# Altium schematic sheet SCH-ZB206B-0B.SchDoc: Title
size A3; PageSetup: Record=PageOptions|CenterHorizontal=True|CenterVertical=True|PrintScale=1.00|XCorrection=1.00|YCorrection=1.00|PrintKind=0|BorderSize=5000000|LeftOffset=0|BottomOffset=0|Orientation=2|PaperLength=1000|PaperWidth=1000|Scale=100|PaperSource=7|PrintQuality=-4|MediaType=1|DitherType=10|PaperKind=A4|PrintScaleMode=1; ApprovedBy: Approve; CheckedBy: Check; DrawnBy: 叶天宝; Organization: HNS; DocumentNumber: 5; SheetNumber: 5; SheetTotal: 5
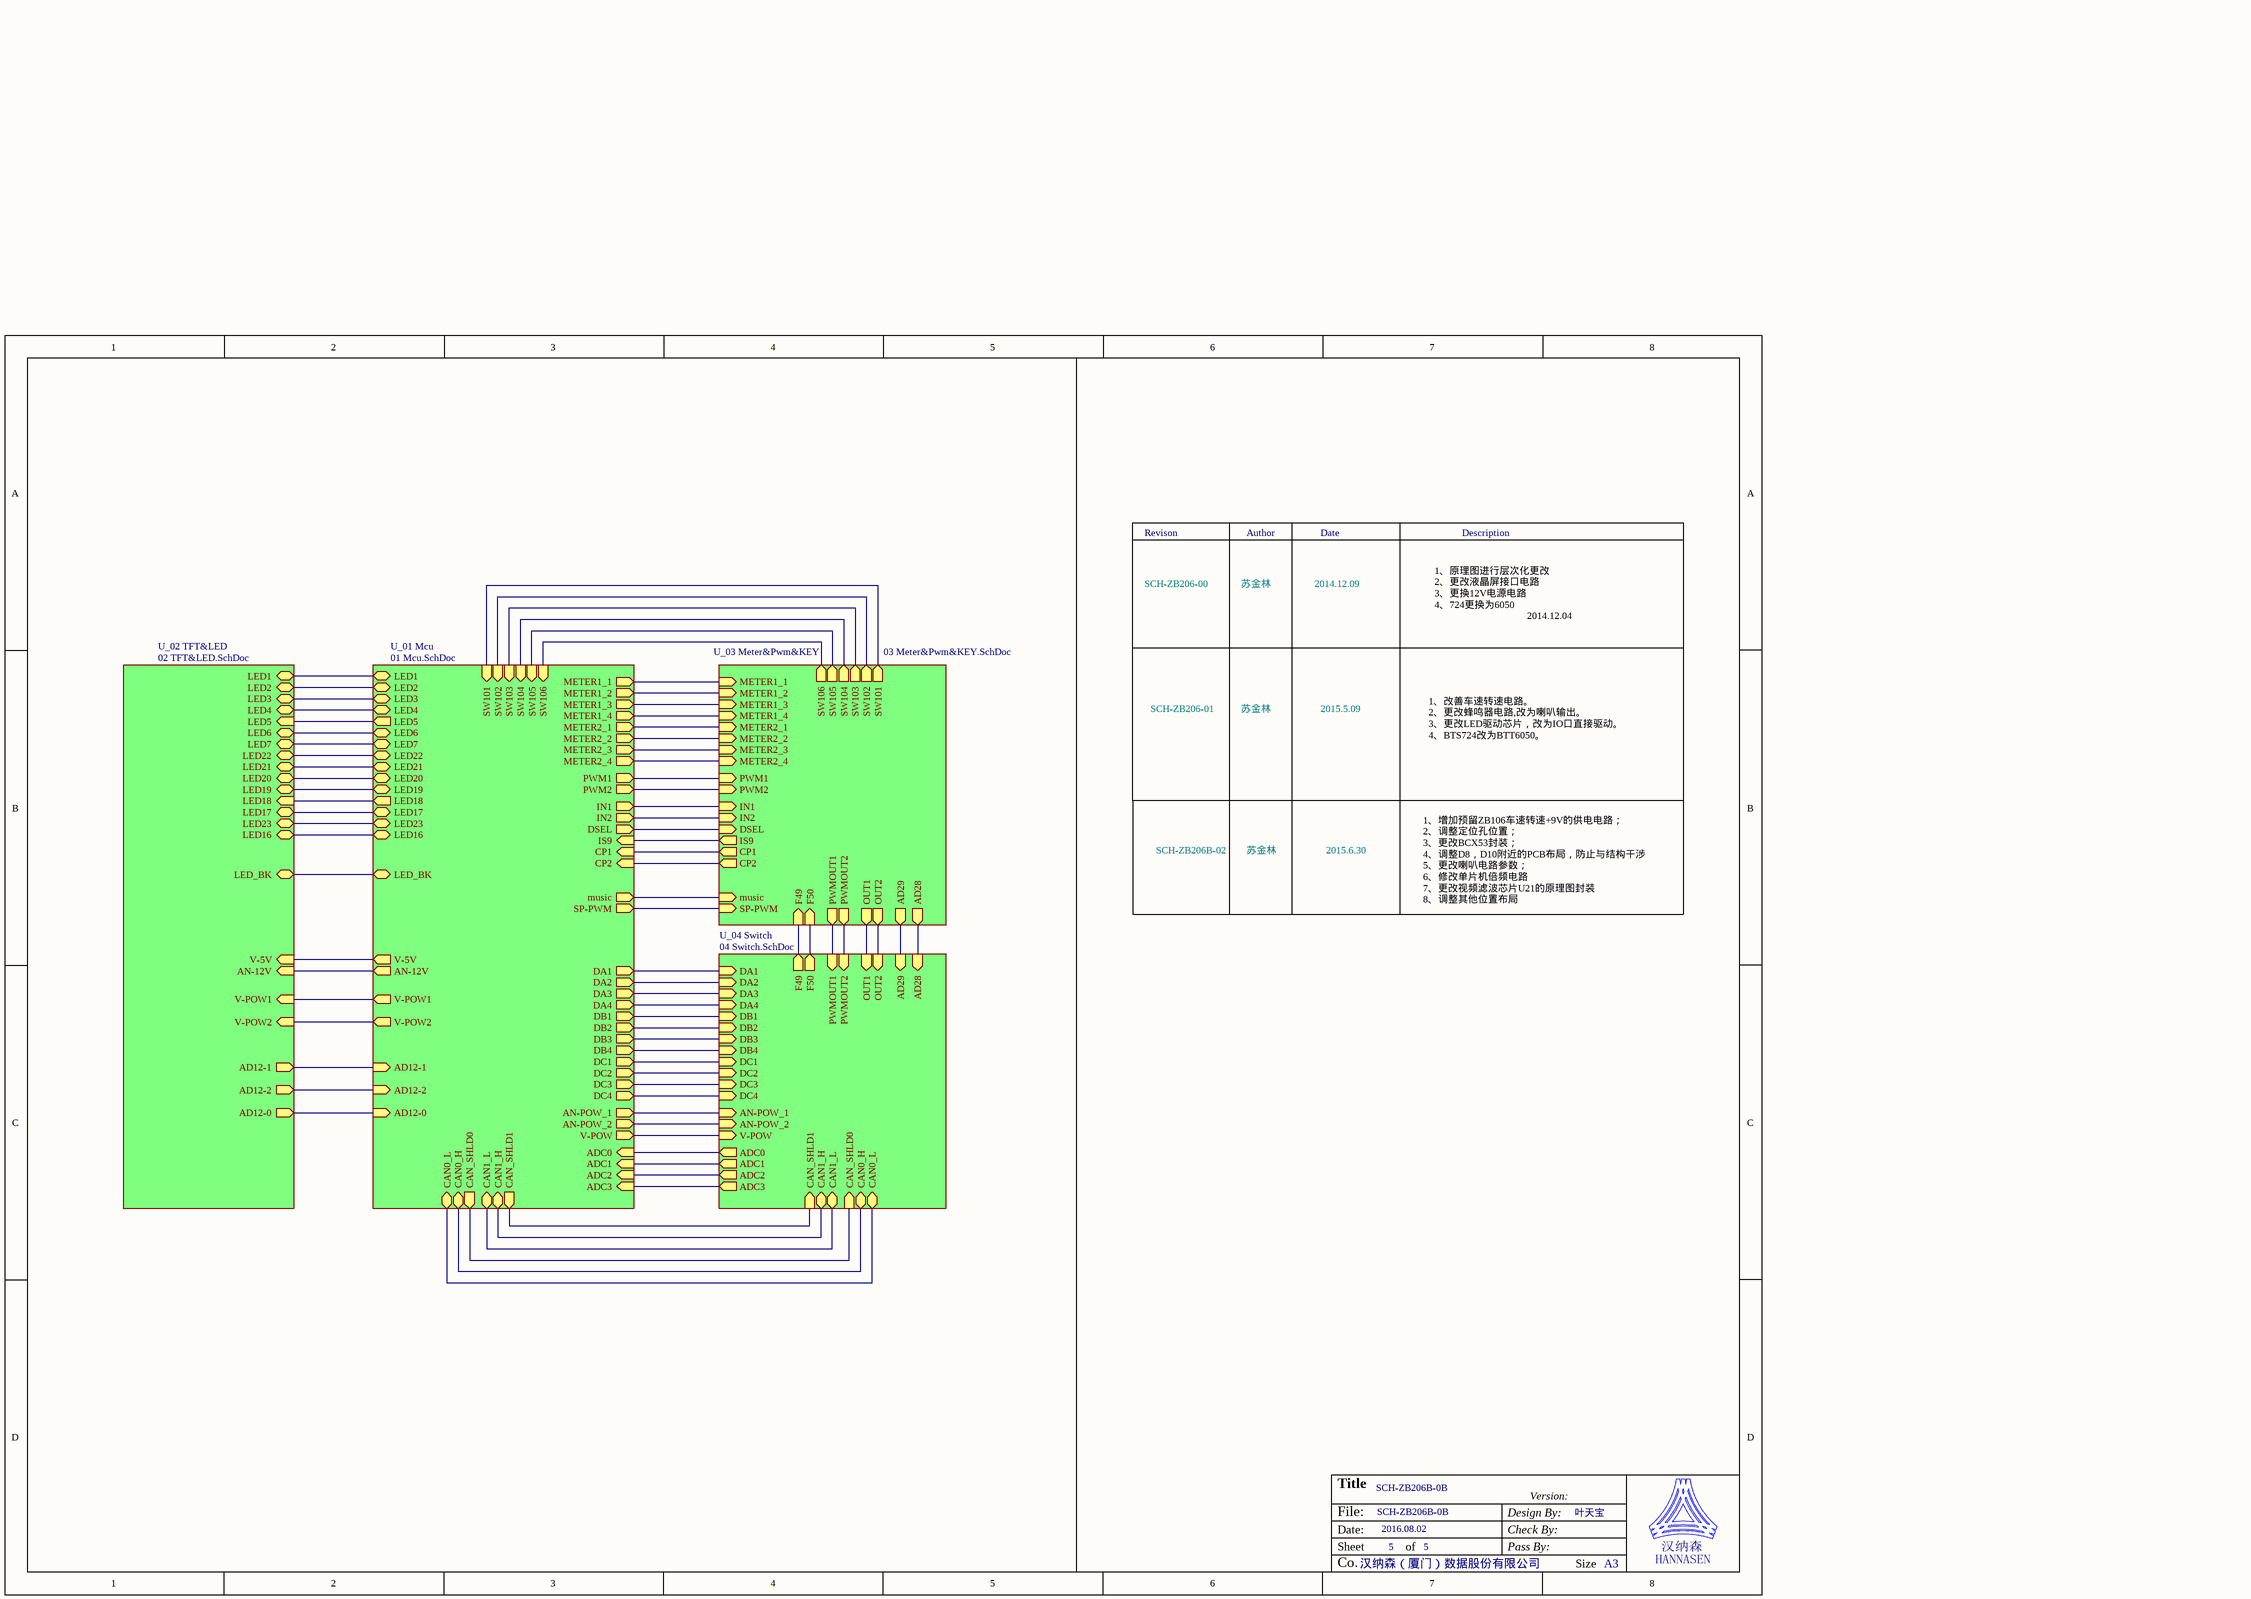
[diagram p0: SCH-ZB206B-0B.SchDoc]

## Sub-sheets
U_01 Mcu = 01 Mcu.SchDoc: METER1_1 (out), METER1_2 (out), METER1_3 (out), METER1_4 (out), METER2_1 (out), METER2_2 (out), METER2_3 (out), METER2_4 (out), SW101 (in), SW102 (in), SW103 (in), SW104 (in), SW105 (in), SW106 (in), CP1 (in), CP2 (in), DA1 (out), DA2 (out), DA3 (out), DA4 (out), DB1 (out), DB2 (out), DB3 (out), DB4 (out), DC1 (out), DC2 (out), DC3 (out), DC4 (out), ADC0 (in), ADC1 (in), ADC2 (in), ADC3 (in), PWM1 (out), PWM2 (out), V-POW (out), AN-POW_1 (out), V-5V (out), IN1 (out), IN2 (out), V-POW1 (out), AN-12V (out), LED6 (bidir), LED7 (bidir), LED1 (bidir), LED2 (bidir), LED3 (bidir), LED4 (bidir), LED5 (out), CAN_SHLD1 (out), CAN1_H (bidir), CAN1_L (bidir), CAN_SHLD0 (out), CAN0_H (bidir), CAN0_L (bidir), V-POW2 (out), AD12-1 (in), AD12-2 (in), IS9 (in), DSEL (out), AN-POW_2 (out), music (out), SP-PWM (out), LED17 (bidir), LED22 (bidir), LED21 (bidir), LED20 (bidir), LED19 (bidir), LED18 (out), LED_BK (bidir), LED23 (bidir), LED16 (bidir), AD12-0 (in)
U_02 TFT&LED = 02 TFT&LED.SchDoc: V-5V (in), AD12-0 (out), AN-12V (in), LED2 (bidir), LED1 (bidir), LED3 (bidir), LED4 (bidir), LED5 (in), LED6 (bidir), LED7 (bidir), V-POW1 (in), AD12-1 (out), AD12-2 (out), V-POW2 (in), LED21 (bidir), LED22 (bidir), LED20 (bidir), LED19 (bidir), LED18 (in), LED17 (bidir), LED_BK (bidir), LED23 (bidir), LED16 (bidir)
U_03 Meter&Pwm&KEY = 03 Meter&Pwm&KEY.SchDoc: PWM1 (in), PWMOUT1 (out), PWM2 (in), PWMOUT2 (out), METER1_1 (in), METER1_2 (in), METER1_3 (in), METER1_4 (in), METER2_1 (in), METER2_2 (in), METER2_3 (in), METER2_4 (in), CP1 (out), CP2 (out), F50 (in), F49 (in), OUT1 (out), OUT2 (out), IN1 (in), IN2 (in), SW101 (out), SW102 (out), SW103 (out), SW104 (out), SW105 (out), SW106 (out), DSEL (in), IS9 (out), SP-PWM (in), music (in), AD29 (out), AD28 (out)
U_04 Switch = 04 Switch.SchDoc: F49 (out), F50 (out), PWMOUT1 (in), PWMOUT2 (in), CAN0_H (bidir), CAN_SHLD0 (in), CAN0_L (bidir), CAN1_L (bidir), CAN1_H (bidir), CAN_SHLD1 (in), ADC0 (out), ADC1 (out), ADC2 (out), ADC3 (out), DA1 (in), DA2 (in), DA3 (in), DA4 (in), DB1 (in), DB2 (in), DB3 (in), DB4 (in), DC1 (in), DC2 (in), DC3 (in), DC4 (in), AN-POW_1 (in), OUT1 (in), OUT2 (in), V-POW (in), AD29 (in), AN-POW_2 (in), AD28 (in)

## Nets
(unnamed): sheet U_04 Switch/F49, sheet U_03 Meter&Pwm&KEY/F49
(unnamed): sheet U_04 Switch/F50, sheet U_03 Meter&Pwm&KEY/F50
(unnamed): sheet U_04 Switch/PWMOUT1, sheet U_03 Meter&Pwm&KEY/PWMOUT1
(unnamed): sheet U_04 Switch/PWMOUT2, sheet U_03 Meter&Pwm&KEY/PWMOUT2
(unnamed): sheet U_04 Switch/CAN0_H, sheet U_01 Mcu/CAN0_H
(unnamed): sheet U_04 Switch/CAN_SHLD0, sheet U_01 Mcu/CAN_SHLD0
(unnamed): sheet U_04 Switch/CAN0_L, sheet U_01 Mcu/CAN0_L
(unnamed): sheet U_04 Switch/CAN1_L, sheet U_01 Mcu/CAN1_L
(unnamed): sheet U_04 Switch/CAN1_H, sheet U_01 Mcu/CAN1_H
(unnamed): sheet U_04 Switch/CAN_SHLD1, sheet U_01 Mcu/CAN_SHLD1
(unnamed): sheet U_04 Switch/ADC0, sheet U_01 Mcu/ADC0
(unnamed): sheet U_04 Switch/ADC1, sheet U_01 Mcu/ADC1
(unnamed): sheet U_04 Switch/ADC2, sheet U_01 Mcu/ADC2
(unnamed): sheet U_04 Switch/ADC3, sheet U_01 Mcu/ADC3
(unnamed): sheet U_04 Switch/DA1, sheet U_01 Mcu/DA1
(unnamed): sheet U_04 Switch/DA2, sheet U_01 Mcu/DA2
(unnamed): sheet U_04 Switch/DA3, sheet U_01 Mcu/DA3
(unnamed): sheet U_04 Switch/DA4, sheet U_01 Mcu/DA4
(unnamed): sheet U_04 Switch/DB1, sheet U_01 Mcu/DB1
(unnamed): sheet U_04 Switch/DB2, sheet U_01 Mcu/DB2
(unnamed): sheet U_04 Switch/DB3, sheet U_01 Mcu/DB3
(unnamed): sheet U_04 Switch/DB4, sheet U_01 Mcu/DB4
(unnamed): sheet U_04 Switch/DC1, sheet U_01 Mcu/DC1
(unnamed): sheet U_04 Switch/DC2, sheet U_01 Mcu/DC2
(unnamed): sheet U_04 Switch/DC3, sheet U_01 Mcu/DC3
(unnamed): sheet U_04 Switch/DC4, sheet U_01 Mcu/DC4
(unnamed): sheet U_04 Switch/AN-POW_1, sheet U_01 Mcu/AN-POW_1
(unnamed): sheet U_04 Switch/OUT1, sheet U_03 Meter&Pwm&KEY/OUT1
(unnamed): sheet U_04 Switch/OUT2, sheet U_03 Meter&Pwm&KEY/OUT2
(unnamed): sheet U_04 Switch/V-POW, sheet U_01 Mcu/V-POW
(unnamed): sheet U_04 Switch/AD29, sheet U_03 Meter&Pwm&KEY/AD29
(unnamed): sheet U_04 Switch/AN-POW_2, sheet U_01 Mcu/AN-POW_2
(unnamed): sheet U_04 Switch/AD28, sheet U_03 Meter&Pwm&KEY/AD28
(unnamed): sheet U_01 Mcu/METER1_1, sheet U_03 Meter&Pwm&KEY/METER1_1
(unnamed): sheet U_01 Mcu/METER1_2, sheet U_03 Meter&Pwm&KEY/METER1_2
(unnamed): sheet U_01 Mcu/METER1_3, sheet U_03 Meter&Pwm&KEY/METER1_3
(unnamed): sheet U_01 Mcu/METER1_4, sheet U_03 Meter&Pwm&KEY/METER1_4
(unnamed): sheet U_01 Mcu/METER2_1, sheet U_03 Meter&Pwm&KEY/METER2_1
(unnamed): sheet U_01 Mcu/METER2_2, sheet U_03 Meter&Pwm&KEY/METER2_2
(unnamed): sheet U_01 Mcu/METER2_3, sheet U_03 Meter&Pwm&KEY/METER2_3
(unnamed): sheet U_01 Mcu/METER2_4, sheet U_03 Meter&Pwm&KEY/METER2_4
(unnamed): sheet U_01 Mcu/SW101, sheet U_03 Meter&Pwm&KEY/SW101
(unnamed): sheet U_01 Mcu/SW102, sheet U_03 Meter&Pwm&KEY/SW102
(unnamed): sheet U_01 Mcu/SW103, sheet U_03 Meter&Pwm&KEY/SW103
(unnamed): sheet U_01 Mcu/SW104, sheet U_03 Meter&Pwm&KEY/SW104
(unnamed): sheet U_01 Mcu/SW105, sheet U_03 Meter&Pwm&KEY/SW105
(unnamed): sheet U_01 Mcu/SW106, sheet U_03 Meter&Pwm&KEY/SW106
(unnamed): sheet U_01 Mcu/CP1, sheet U_03 Meter&Pwm&KEY/CP1
(unnamed): sheet U_01 Mcu/CP2, sheet U_03 Meter&Pwm&KEY/CP2
(unnamed): sheet U_01 Mcu/PWM1, sheet U_03 Meter&Pwm&KEY/PWM1
(unnamed): sheet U_01 Mcu/PWM2, sheet U_03 Meter&Pwm&KEY/PWM2
(unnamed): sheet U_01 Mcu/V-5V, sheet U_02 TFT&LED/V-5V
(unnamed): sheet U_01 Mcu/IN1, sheet U_03 Meter&Pwm&KEY/IN1
(unnamed): sheet U_01 Mcu/IN2, sheet U_03 Meter&Pwm&KEY/IN2
(unnamed): sheet U_01 Mcu/V-POW1, sheet U_02 TFT&LED/V-POW1
(unnamed): sheet U_01 Mcu/AN-12V, sheet U_02 TFT&LED/AN-12V
(unnamed): sheet U_01 Mcu/LED6, sheet U_02 TFT&LED/LED6
(unnamed): sheet U_01 Mcu/LED7, sheet U_02 TFT&LED/LED7
(unnamed): sheet U_01 Mcu/LED1, sheet U_02 TFT&LED/LED1
(unnamed): sheet U_01 Mcu/LED2, sheet U_02 TFT&LED/LED2
(unnamed): sheet U_01 Mcu/LED3, sheet U_02 TFT&LED/LED3
(unnamed): sheet U_01 Mcu/LED4, sheet U_02 TFT&LED/LED4
(unnamed): sheet U_01 Mcu/LED5, sheet U_02 TFT&LED/LED5
(unnamed): sheet U_01 Mcu/V-POW2, sheet U_02 TFT&LED/V-POW2
(unnamed): sheet U_01 Mcu/AD12-1, sheet U_02 TFT&LED/AD12-1
(unnamed): sheet U_01 Mcu/AD12-2, sheet U_02 TFT&LED/AD12-2
(unnamed): sheet U_01 Mcu/IS9, sheet U_03 Meter&Pwm&KEY/IS9
(unnamed): sheet U_01 Mcu/DSEL, sheet U_03 Meter&Pwm&KEY/DSEL
(unnamed): sheet U_01 Mcu/music, sheet U_03 Meter&Pwm&KEY/music
(unnamed): sheet U_01 Mcu/SP-PWM, sheet U_03 Meter&Pwm&KEY/SP-PWM
(unnamed): sheet U_01 Mcu/LED17, sheet U_02 TFT&LED/LED17
(unnamed): sheet U_01 Mcu/LED22, sheet U_02 TFT&LED/LED22
(unnamed): sheet U_01 Mcu/LED21, sheet U_02 TFT&LED/LED21
(unnamed): sheet U_01 Mcu/LED20, sheet U_02 TFT&LED/LED20
(unnamed): sheet U_01 Mcu/LED19, sheet U_02 TFT&LED/LED19
(unnamed): sheet U_01 Mcu/LED18, sheet U_02 TFT&LED/LED18
(unnamed): sheet U_01 Mcu/LED_BK, sheet U_02 TFT&LED/LED_BK
(unnamed): sheet U_01 Mcu/LED23, sheet U_02 TFT&LED/LED23
(unnamed): sheet U_01 Mcu/LED16, sheet U_02 TFT&LED/LED16
(unnamed): sheet U_01 Mcu/AD12-0, sheet U_02 TFT&LED/AD12-0

## Notes on the sheet
- Revison
- Author
- Date
- Description
- SCH-ZB206-00
- 苏金林
- 2014.12.09
- 1、原理图进行层次化更改
  2、更改液晶屏接口电路
  3、更换12V电源电路
  4、724更换为6050
  2014.12.04
- SCH-ZB206-01
- 2015.5.09
- 1、改善车速转速电路。
  2、更改蜂鸣器电路,改为喇叭输出。
  3、更改LED驱动芯片，改为IO口直接驱动。
  4、BTS724改为BTT6050。
- SCH-ZB206B-02
- 2015.6.30
- 1、增加预留ZB106车速转速+9V的供电电路；
  2、调整定位孔位置；
  3、更改BCX53封装；
  4、调整D8，D10附近的PCB布局，防止与结构干涉
  5、更改喇叭电路参数；
  6、修改单片机倍频电路
  7、更改视频滤波芯片U21的原理图封装
  8、调整其他位置布局
- SCH-ZB206B-0B
- 2016.08.02
- 5
- 叶天宝
- Title
- Version:
- File:
- Date:
- Sheet
- of
- Design By:
- Check By:
- Pass By:
- Co.
- 汉纳森（厦门）数据股份有限公司
- Size
- A3